# EAGLE design Grove - Collision Sensor v2.0 (EAGLE 6.3)
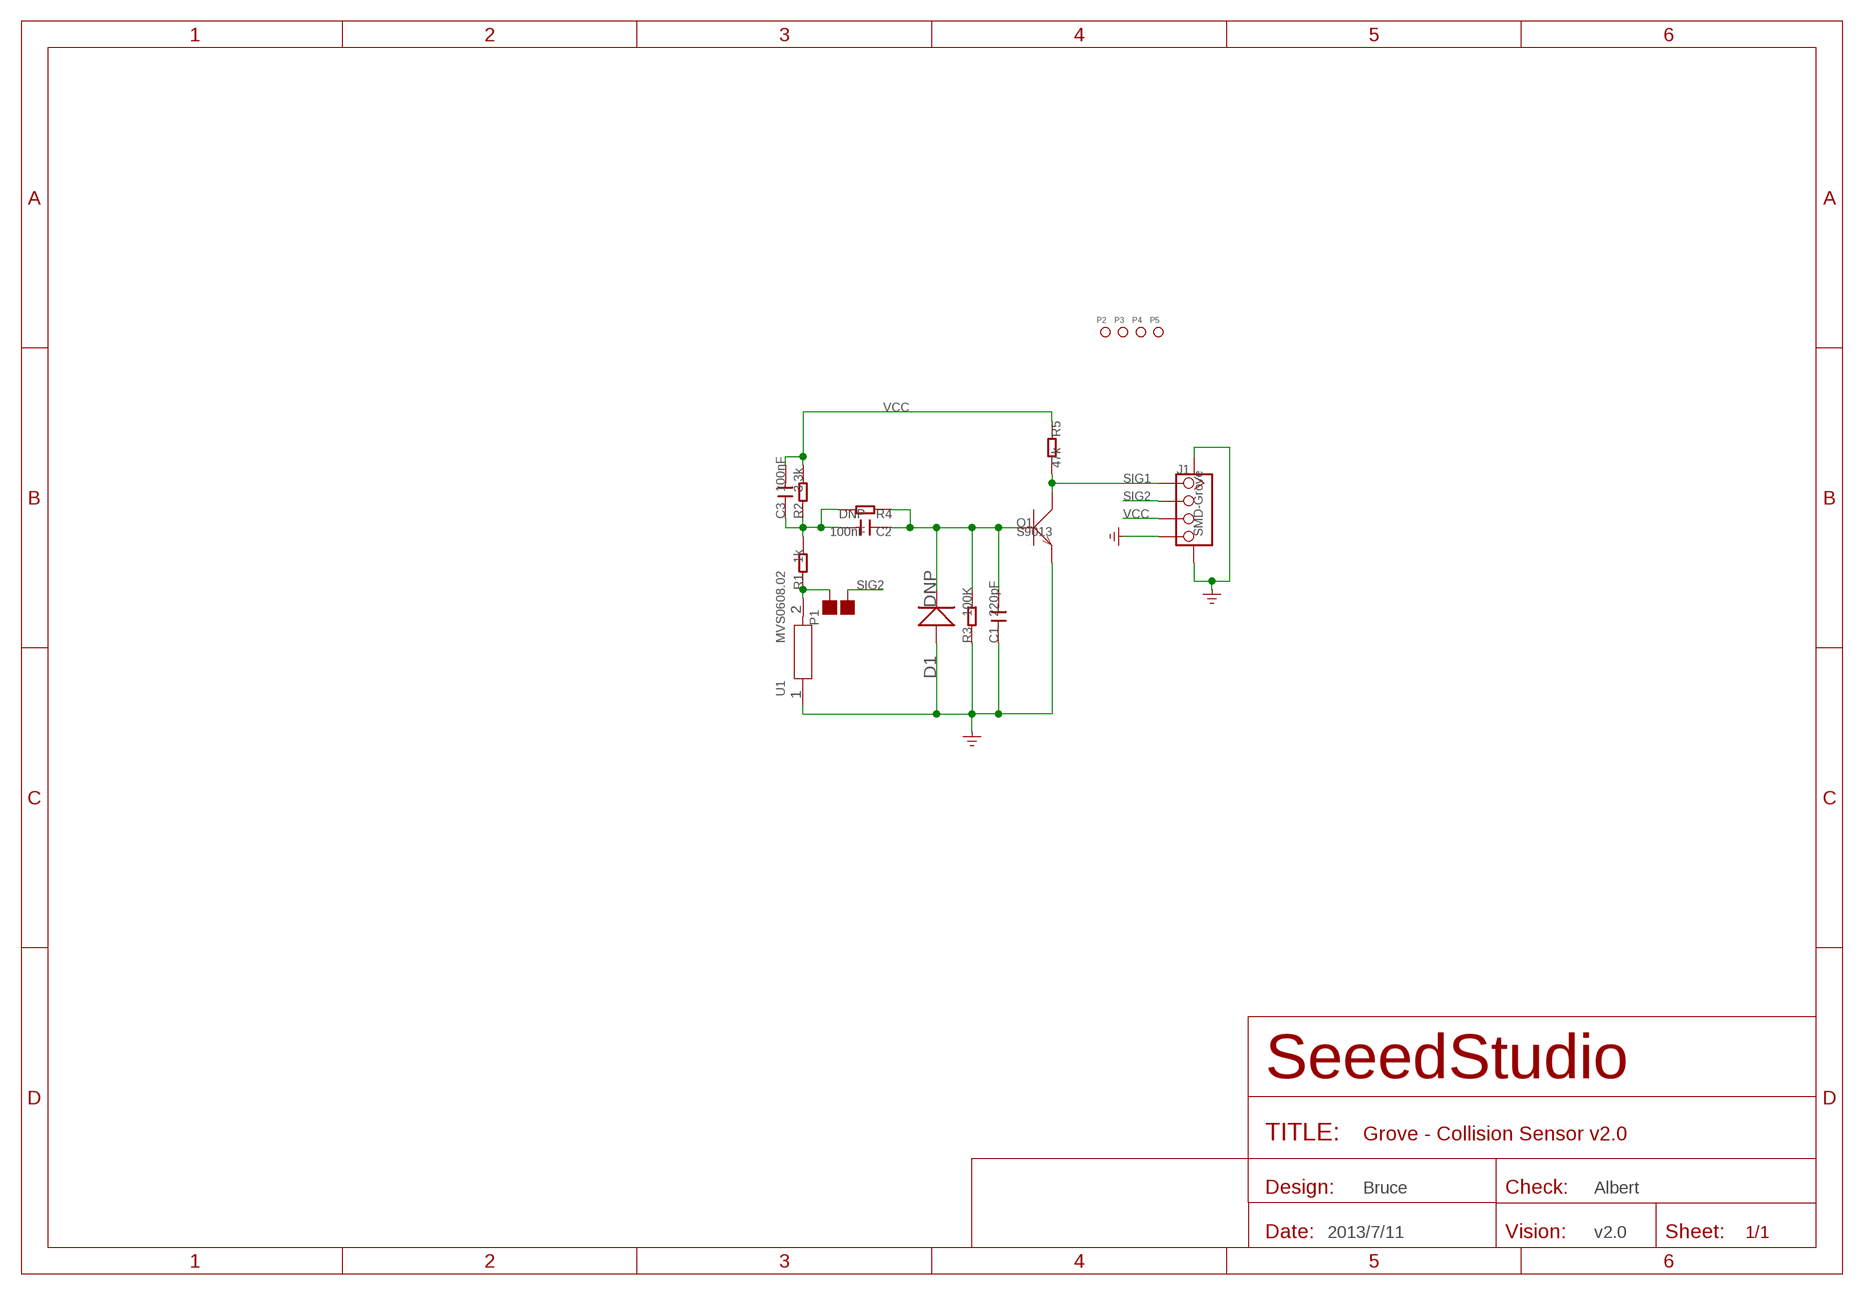
[diagram p0: schematic, sheet 1]

## Parts
C1  220pF  C-0603  [C0603]
C2  100nF  C-0603  [C0603]
C3  100nF  C-0603  [C0603]
D1  DNP  D'1206'  [SOD123]
J1  SMD-Grove  TWIG-4P-2.0-SMD-FEMALE-REINFORCE'DD'  [4P-SMD-2.0]
P1  DNP  PAD-JUMPER-2P  [2P-SMD-1.78X1.27]
P2  PAD-MARK  [ROUND-MARK-1.0]
P3  PAD-MARK  [ROUND-MARK-1.0]
P4  PAD-MARK  [ROUND-MARK-1.0]
P5  PAD-MARK  [ROUND-MARK-1.0]
Q1  S9013  TRANSISTOR-NPN-SOT23  [SOT23]
R1  1k  R-0603  [R0603]
R2  3.3k  R-0603  [R0603]
R3  100K  R-0603  [R0603]
R4  DNP  R-0603  [R0603]
R5  47k  R-0603  [R0603]
U1  MVS0608.02  [2P-2.45X2.85X1.7H]

## Nets
GND: C1.1 D1.+ J1.4 J1.SS1 J1.SS2 Q1.2(E) R3.1 U1.1
N$1: P1.2 R1.1 U1.2
N$2: C2.2 C3.1 R1.2 R2.1 R4.2
N$4: C1.2 C2.1 D1.- Q1.1(B) R3.2 R4.1
SIG1: J1.1 Q1.3(C) R5.2
SIG2: J1.2 P1.1
VCC: C3.2 J1.3 R2.2 R5.1

## Notes on the sheet
- Bruce | Albert
- 2013/7/11 | v2.0

## Library data of the parts
C1-C3 = Discrete:C*: Ceramic Capacitors
D1 = Discrete:D*
J1 = Connector:TWIG-4P-2.0-SMD-FEMALE-REINFORCE
P1 = Discrete:PAD-JUMPER-2P; PARTNO: DNP
P2-P5 = Discrete:PAD-MARK; PARTNO: DNP
Q1 = Discrete:TRANSISTOR-NPN*: NPN audion
R1-R5 = Discrete:R*
U1 = template:MVS0608.02: The micro vibration switch detects vibrations by means of a micro ball (d=0.8 mm). The ball bridges two contacts reducing the resistance between the two external

## Board
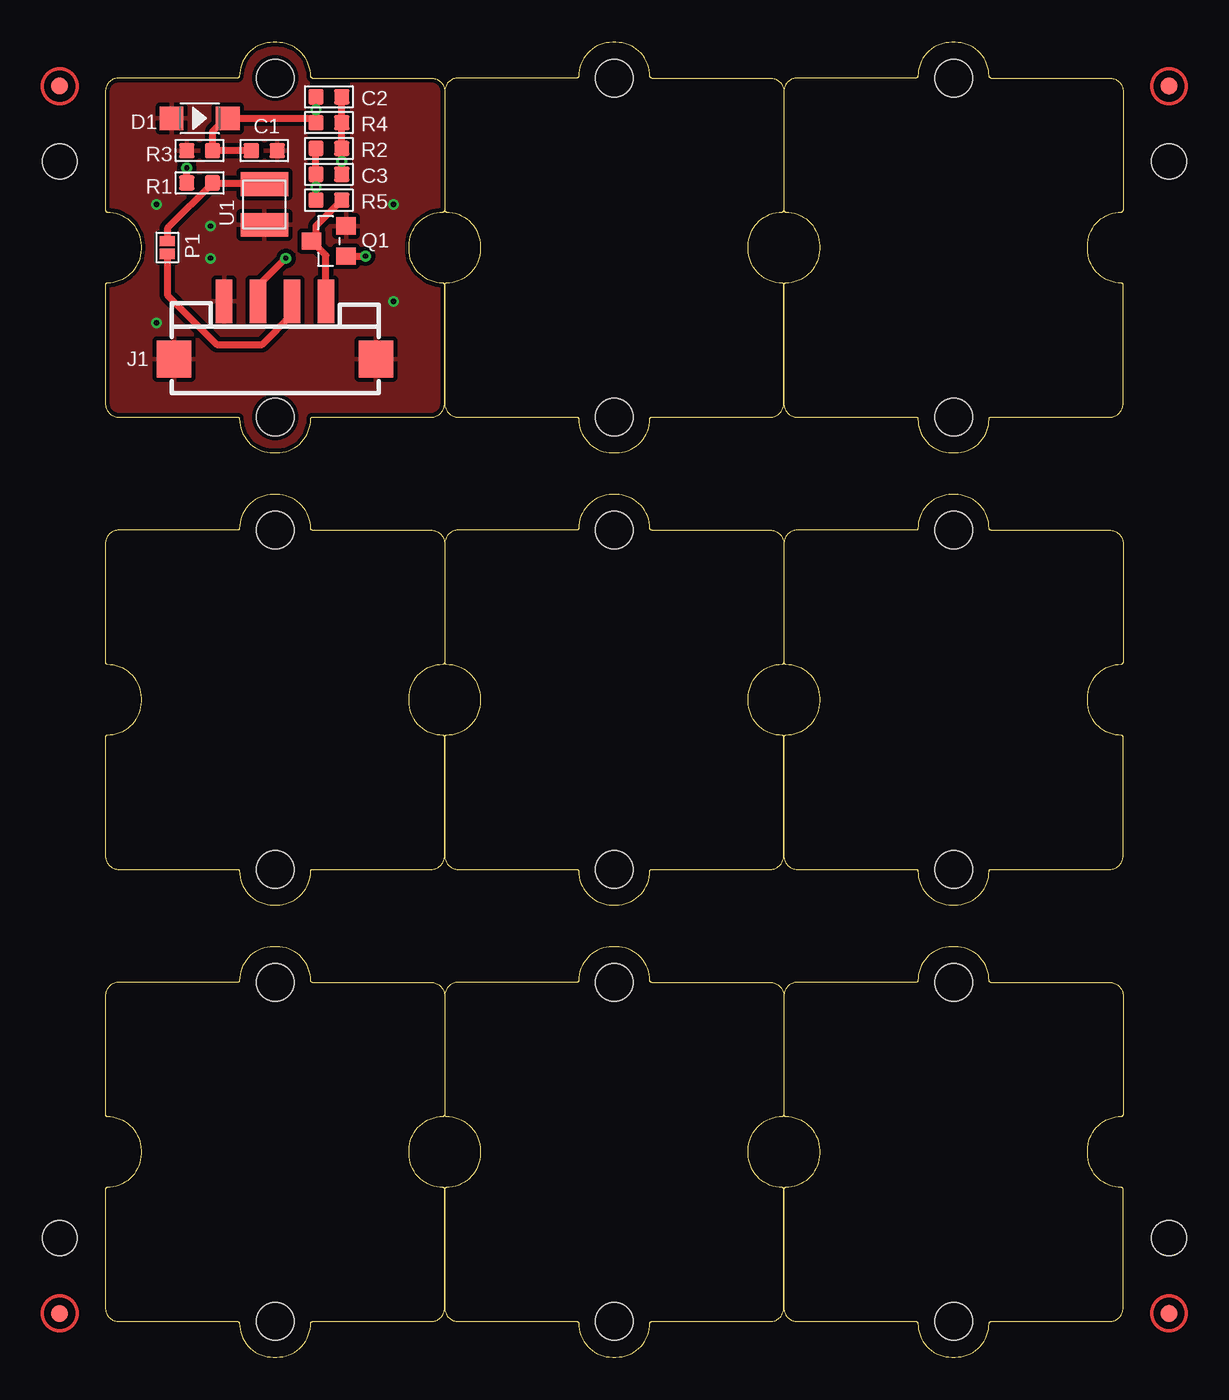
[diagram p1: board, top side]
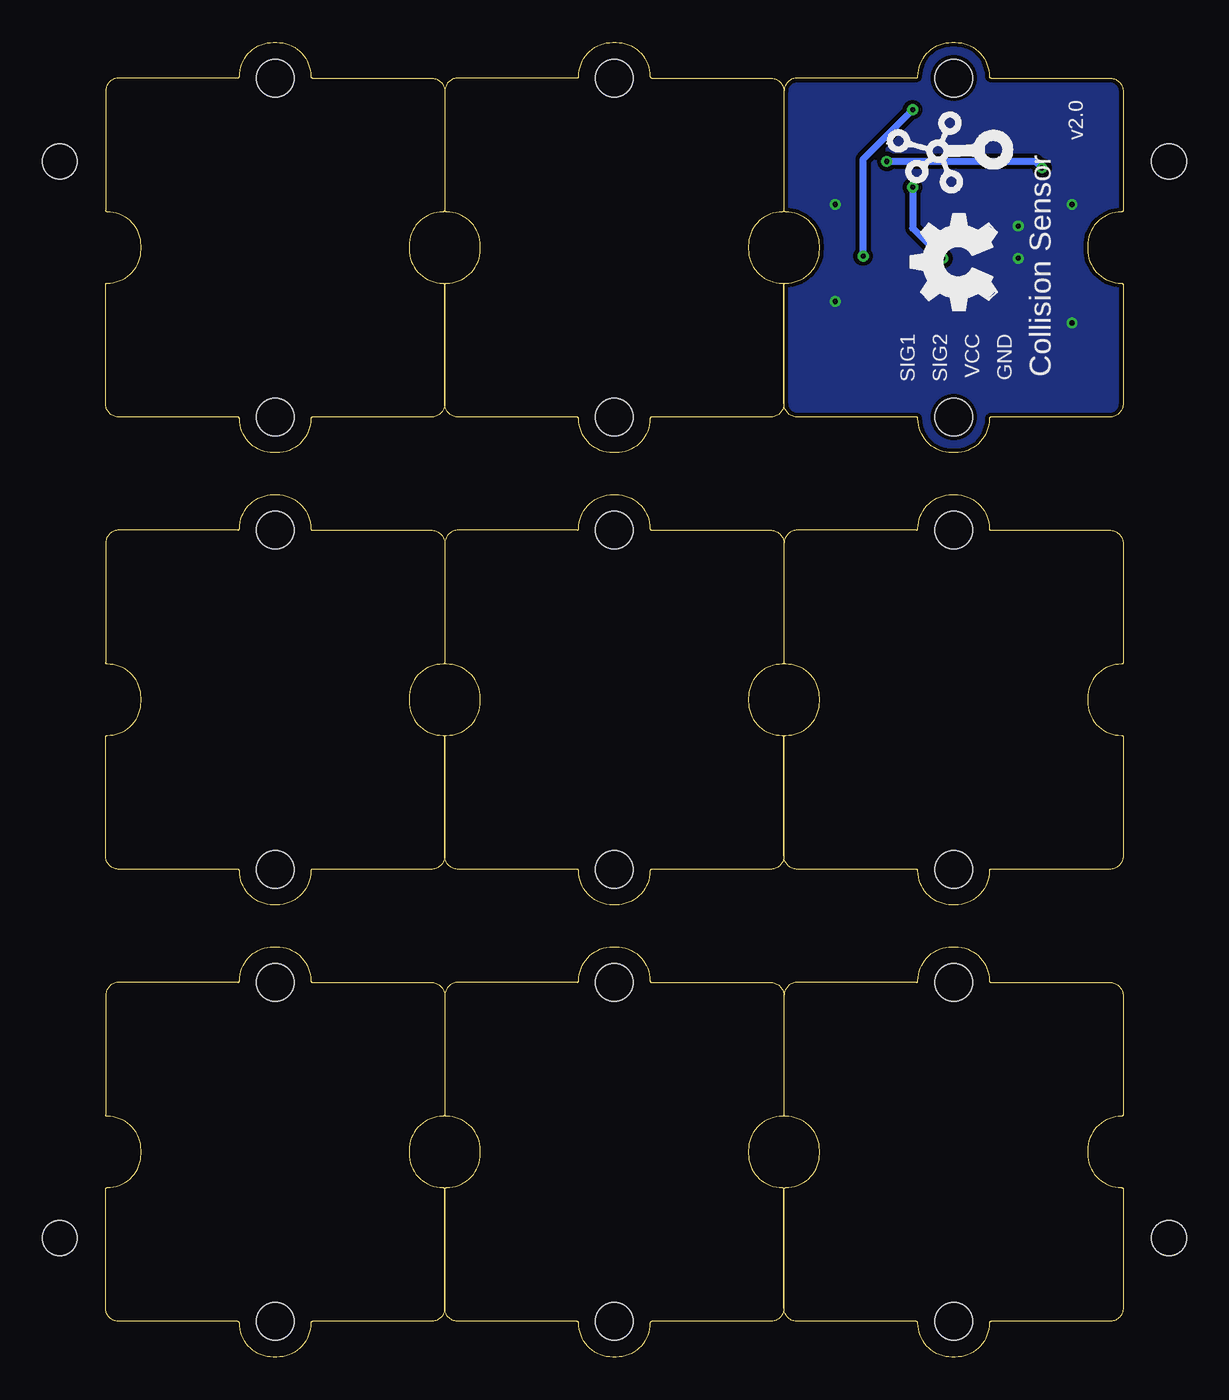
[diagram p2: board, bottom side, seen from below]

Size 60 x 77.54 mm. Coordinates in mm from the lower left corner, seen from the top.
Copper layers (1*16): Top 0.035mm / dielectric 1.5mm / Bottom 0.035mm
Design rules "SeeedStudio_rule_no_angle_090911 *": minimum track width 6mil, minimum drill 12mil, track to track 6mil, track to pad 6mil, pad to pad 6mil, via to via 6mil, smd to smd 0mil, copper to edge 10mil, drill to drill 10mil, minimum pad ring 10mil, minimum via ring 6mil, stop-mask expansion 2mil, vias tented up to drill 25mil, thermal gap 10mil
Holes 2.03 mm at -2.7,70.52 62.7,7.02 -2.7,7.02 62.7,70.52

### Footprints (pad centres in the part's own frame; a part is rotated, then mirrored left to right if it is on the bottom)
C0603 = smd 0.889 x 0.889: 1 -0.762,0; 2 0.762,0
SOD123 = smd 1.397 x 1.397: + -1.651,0; - 1.651,0
4P-SMD-2.0 = smd 0.965 x 2.54: 1 -3,0; 2 -1,0; 3 1,0; 4 3,0 | smd 2.032 x 2.184: SS1 -5.946,3.4; SS2 5.946,3.4
2P-SMD-1.78X1.27 = smd 0.889 x 0.61: 1 0,0.381; 2 0,-0.381
ROUND-MARK-1.0 = smd 1.016 x 1.016: P$1 0,0
SOT23 = smd 1.016 x 1.143: 1 -0.889,-1.016; 2 0.889,-1.016; 3 0,1.016
R0603 = smd 0.889 x 0.889: 1 -0.762,0; 2 0.762,0
2P-2.45X2.85X1.7H = smd 1.4 x 2.8: 1 -1.2,0; 2 1.2,0
1U-DIM-W/-DRILL = hole 2.2: 0,-10; 0,10

### Placement (x,y rotation side)
C1  9.37,71.16 180 top
C2  13.18,74.33 0 top
C3  13.18,69.76 180 top
D1  5.55,73.06 0 top
J1  10,62.27 180 top
P1  3.65,65.44 180 top
P2  62.7,2.57 0 top
P3  -2.7,2.57 0 top
P4  62.7,74.97 0 top
P5  -2.7,74.97 0 top
Q1  13.18,65.82 90 top
R1  5.55,69.25 180 top
R2  13.18,71.28 180 top
R3  5.55,71.16 0 top
R4  13.18,72.81 0 top
R5  13.18,68.23 0 top
U1  9.37,67.98 90 top
U$5  [OSHW_FILLX200_NOTEXT]  7.45,61.76 90 bottom
U$6  [1U-DIM-W/-DRILL]  10,65.44 0 top
U$7  [TWIGLOGO]  7.45,71.16 90 bottom
U$8  [1U-DIM-W/-DRILL]  30,65.44 0 top
U$9  [1U-DIM-W/-DRILL]  50,65.44 0 top
U$10  [1U-DIM-W/-DRILL]  10,38.77 0 top
U$11  [1U-DIM-W/-DRILL]  30,38.77 0 top
U$12  [1U-DIM-W/-DRILL]  50,38.77 0 top
U$13  [1U-DIM-W/-DRILL]  10,12.1 0 top
U$14  [1U-DIM-W/-DRILL]  30,12.1 0 top
U$15  [1U-DIM-W/-DRILL]  50,12.1 0 top

### Tracks (layer width: path | path; a pad name or v marks a point on that pad's centre or on a via)
GND  (via drill 0.3 pad 0.64)
  other vias: 3.01,60.99 6.19,64.8 6.19,66.71 3.01,67.98 16.98,62.27 16.98,67.98
  pour Bottom (isolate 0.254): -0.54,77.89 21.81,77.89 21.94,52.74 -0.54,52.74
  pour Top (isolate 0.254): -0.54,77.89 21.81,77.89 21.94,52.74 -0.54,52.74
N$1
  Top 0.406: P1.2 3.65,66.58 R1.1 9.29,69.25 U1.2
N$2  (via drill 0.3 pad 0.64)
  Top 0.406: C2.2 R4.2 R2.1 C3.1 v13.94,70.52 | R1.2 v4.79,70.14
  Bottom 0.406: v13.94,70.52 5.17,70.52 v4.79,70.14
N$4  (via drill 0.3 pad 0.64)
  Top 0.406: C2.1 v12.41,73.57 12.41,72.93 | 12.41,72.93 R4.1 | 12.41,72.93 12.29,73.06 D1.- 7.08,73.06 6.32,72.3 6.32,71.28 | R3.2 6.32,71.28 | C1.2 6.44,71.16 6.32,71.28 | Q1.1 v15.33,64.93
  Bottom 0.406: v15.33,64.93 15.33,70.65 v12.41,73.57
SIG1
  Top 0.406: J1.1 13,64.98 12.29,65.69 | 12.29,65.69 Q1.3 | R5.2 12.41,66.71 12.41,65.82 12.29,65.69
SIG2
  Top 0.406: P1.1 3.65,62.65 6.57,59.72 9.24,59.72 11.02,61.5 11.02,62.25 J1.2
VCC  (via drill 0.3 pad 0.64)
  Top 0.406: R5.1 v12.41,69 C3.2 R2.2 | J1.3 8.98,62.28 8.98,63.15 v10.63,64.8
  Bottom 0.406: v12.41,69 12.41,66.58 v10.63,64.8

### Text on the board
bPlace: v2.0 | GND | VCC | SIG2 | SIG1 | Collision Sensor